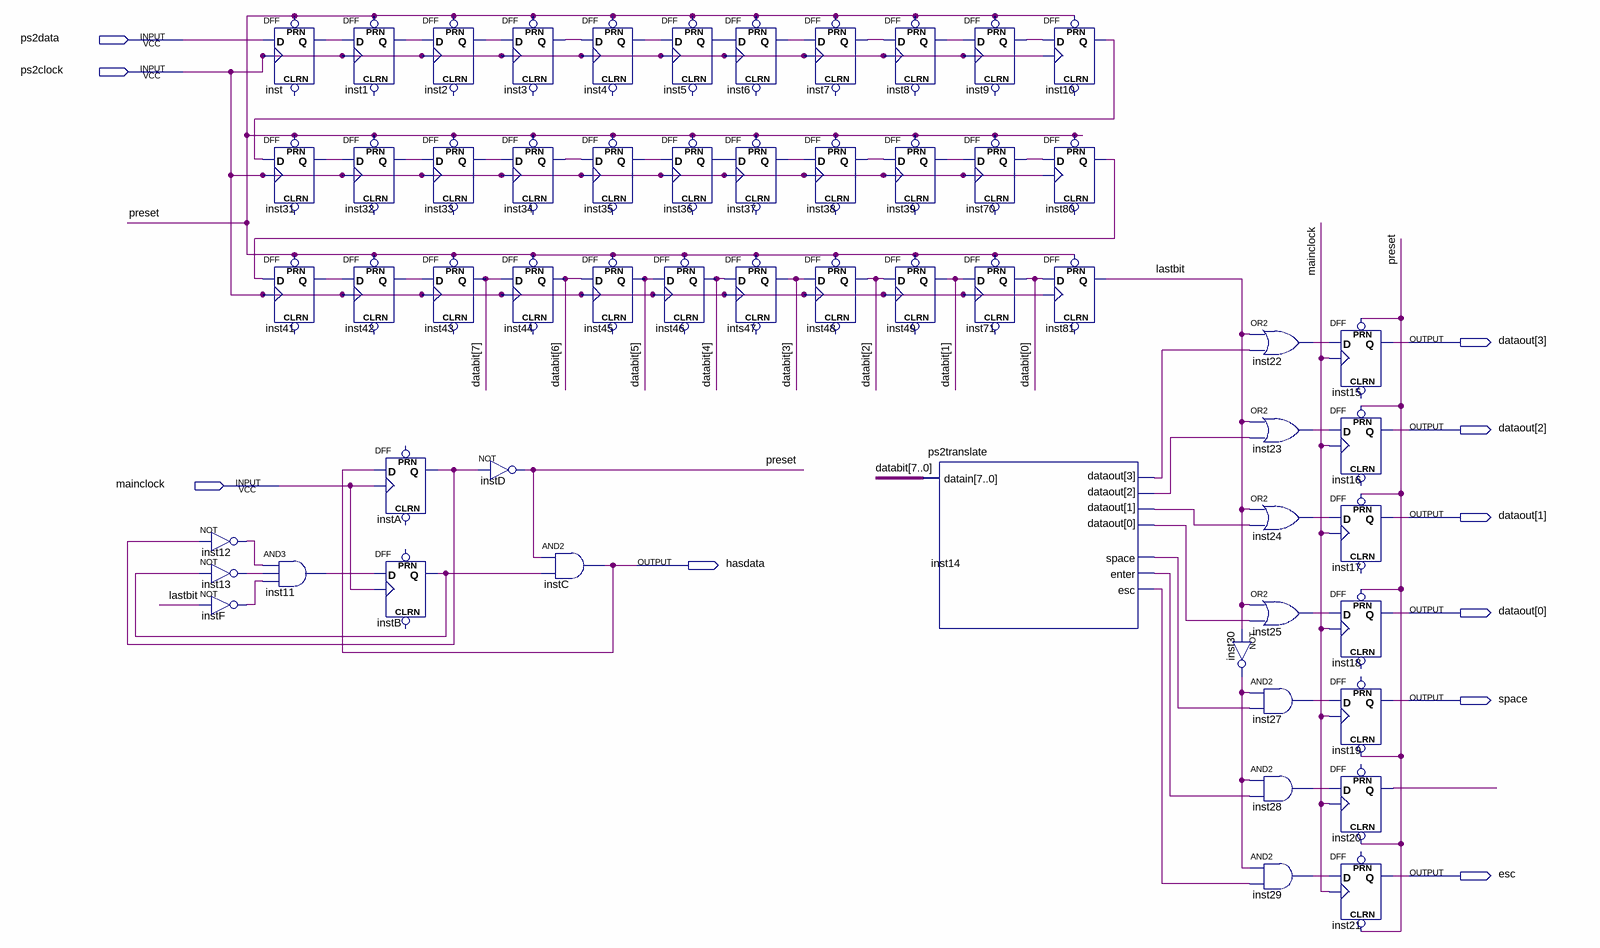
[diagram p0: schematic sheet]
// Quartus schematic ps2keybx.bdf as structural Verilog: 57 symbols, 10 pins
module ps2keybx (
  input  ps2data,
  input  ps2clock,
  input  mainclock,
  output [3:0] dataout,
  output hasdata,
  output space,
  output esc
);

  wire inst1_q, inst2_q, inst3_q, inst4_q, inst5_q, inst6_q, inst7_q, inst8_q, inst9_q, inst10_q, inst11_out,
       inst12_out, inst13_out, inst14_dataout, inst14_dataout_2, inst14_dataout_3, inst14_dataout_4,
       inst14_enter, inst14_esc, inst14_space, inst20_q, inst22_out, inst23_out, inst24_out, inst25_out,
       inst27_out, inst28_out, inst29_out, inst30_out, inst31_q, inst32_q, inst33_q, inst34_q, inst35_q,
       inst36_q, inst37_q, inst38_q, inst39_q, inst41_q, inst42_q, inst70_q, inst80_q, inst_q, instA_q,
       instB_q, instF_out, lastbit, preset;
  wire [7:0] databit;

  not inst12 (inst12_out, instA_q);
  not inst13 (inst13_out, instB_q);
  not instF (instF_out, lastbit);
  DFF inst (.CLK(ps2clock), .D(ps2data), .PRN(preset), .Q(inst_q));  // open: CLRN
  DFF inst31 (.CLK(ps2clock), .D(inst10_q), .PRN(preset), .Q(inst31_q));  // open: CLRN
  DFF inst41 (.CLK(ps2clock), .D(inst80_q), .PRN(preset), .Q(inst41_q));  // open: CLRN
  and inst11 (inst11_out, inst12_out, inst13_out, instF_out);
  DFF inst1 (.CLK(ps2clock), .D(inst_q), .PRN(preset), .Q(inst1_q));  // open: CLRN
  DFF inst32 (.CLK(ps2clock), .D(inst31_q), .PRN(preset), .Q(inst32_q));  // open: CLRN
  DFF inst42 (.CLK(ps2clock), .D(inst41_q), .PRN(preset), .Q(inst42_q));  // open: CLRN
  DFF instA (.CLK(mainclock), .D(hasdata), .Q(instA_q));  // open: CLRN, PRN
  DFF instB (.CLK(mainclock), .D(inst11_out), .Q(instB_q));  // open: CLRN, PRN
  DFF inst2 (.CLK(ps2clock), .D(inst1_q), .PRN(preset), .Q(inst2_q));  // open: CLRN
  DFF inst33 (.CLK(ps2clock), .D(inst32_q), .PRN(preset), .Q(inst33_q));  // open: CLRN
  DFF inst43 (.CLK(ps2clock), .D(inst42_q), .PRN(preset), .Q(databit[7]));  // open: CLRN
  DFF inst3 (.CLK(ps2clock), .D(inst2_q), .PRN(preset), .Q(inst3_q));  // open: CLRN
  DFF inst34 (.CLK(ps2clock), .D(inst33_q), .PRN(preset), .Q(inst34_q));  // open: CLRN
  DFF inst44 (.CLK(ps2clock), .D(databit[7]), .PRN(preset), .Q(databit[6]));  // open: CLRN
  not instD (preset, instA_q);
  DFF inst4 (.CLK(ps2clock), .D(inst3_q), .PRN(preset), .Q(inst4_q));  // open: CLRN
  DFF inst35 (.CLK(ps2clock), .D(inst34_q), .PRN(preset), .Q(inst35_q));  // open: CLRN
  DFF inst45 (.CLK(ps2clock), .D(databit[6]), .PRN(preset), .Q(databit[5]));  // open: CLRN
  and instC (hasdata, preset, instB_q);
  DFF inst5 (.CLK(ps2clock), .D(inst4_q), .PRN(preset), .Q(inst5_q));  // open: CLRN
  DFF inst36 (.CLK(ps2clock), .D(inst35_q), .PRN(preset), .Q(inst36_q));  // open: CLRN
  DFF inst46 (.CLK(ps2clock), .D(databit[5]), .PRN(preset), .Q(databit[4]));  // open: CLRN
  DFF inst6 (.CLK(ps2clock), .D(inst5_q), .PRN(preset), .Q(inst6_q));  // open: CLRN
  DFF inst37 (.CLK(ps2clock), .D(inst36_q), .PRN(preset), .Q(inst37_q));  // open: CLRN
  DFF ints47 (.CLK(ps2clock), .D(databit[4]), .PRN(preset), .Q(databit[3]));  // open: CLRN
  DFF inst7 (.CLK(ps2clock), .D(inst6_q), .PRN(preset), .Q(inst7_q));  // open: CLRN
  DFF inst38 (.CLK(ps2clock), .D(inst37_q), .PRN(preset), .Q(inst38_q));  // open: CLRN
  DFF inst48 (.CLK(ps2clock), .D(databit[3]), .PRN(preset), .Q(databit[2]));  // open: CLRN
  DFF inst8 (.CLK(ps2clock), .D(inst7_q), .PRN(preset), .Q(inst8_q));  // open: CLRN
  DFF inst39 (.CLK(ps2clock), .D(inst38_q), .PRN(preset), .Q(inst39_q));  // open: CLRN
  DFF inst49 (.CLK(ps2clock), .D(databit[2]), .PRN(preset), .Q(databit[1]));  // open: CLRN
  DFF inst9 (.CLK(ps2clock), .D(inst8_q), .PRN(preset), .Q(inst9_q));  // open: CLRN
  DFF inst70 (.CLK(ps2clock), .D(inst39_q), .PRN(preset), .Q(inst70_q));  // open: CLRN
  DFF inst71 (.CLK(ps2clock), .D(databit[1]), .PRN(preset), .Q(databit[0]));  // open: CLRN
  ps2translate inst14 (
    .datain(databit), .space(inst14_space), .enter(inst14_enter), .esc(inst14_esc),
    .dataout({inst14_dataout, inst14_dataout_2, inst14_dataout_4, inst14_dataout_3}));
  DFF inst10 (.CLK(ps2clock), .D(inst9_q), .PRN(preset), .Q(inst10_q));  // open: CLRN
  DFF inst80 (.CLK(ps2clock), .D(inst70_q), .PRN(preset), .Q(inst80_q));  // open: CLRN
  DFF inst81 (.CLK(ps2clock), .D(databit[0]), .PRN(preset), .Q(lastbit));  // open: CLRN
  or inst22 (inst22_out, lastbit, inst14_dataout);
  or inst23 (inst23_out, lastbit, inst14_dataout_2);
  or inst24 (inst24_out, lastbit, inst14_dataout_4);
  or inst25 (inst25_out, lastbit, inst14_dataout_3);
  not inst30 (inst30_out, lastbit);
  and inst27 (inst27_out, inst30_out, inst14_space);
  and inst28 (inst28_out, inst30_out, inst14_enter);
  and inst29 (inst29_out, inst30_out, inst14_esc);
  DFF inst15 (.CLK(mainclock), .D(inst22_out), .PRN(preset), .Q(dataout[3]));  // open: CLRN
  DFF inst16 (.CLK(mainclock), .D(inst23_out), .PRN(preset), .Q(dataout[2]));  // open: CLRN
  DFF inst17 (.CLK(mainclock), .D(inst24_out), .PRN(preset), .Q(dataout[1]));  // open: CLRN
  DFF inst18 (.CLK(mainclock), .D(inst25_out), .PRN(preset), .Q(dataout[0]));  // open: CLRN
  DFF inst19 (.CLRN(preset), .CLK(mainclock), .D(inst27_out), .Q(space));  // open: PRN
  DFF inst20 (.CLRN(preset), .CLK(mainclock), .D(inst28_out), .Q(inst20_q));  // open: PRN
  DFF inst21 (.CLRN(preset), .CLK(mainclock), .D(inst29_out), .Q(esc));  // open: PRN
endmodule
